# Altium schematic sheet LED.SchDoc: Giant 7 Digit I2C Display
size A4; Revision: 1.0; SheetNumber: 1; SheetTotal: 1
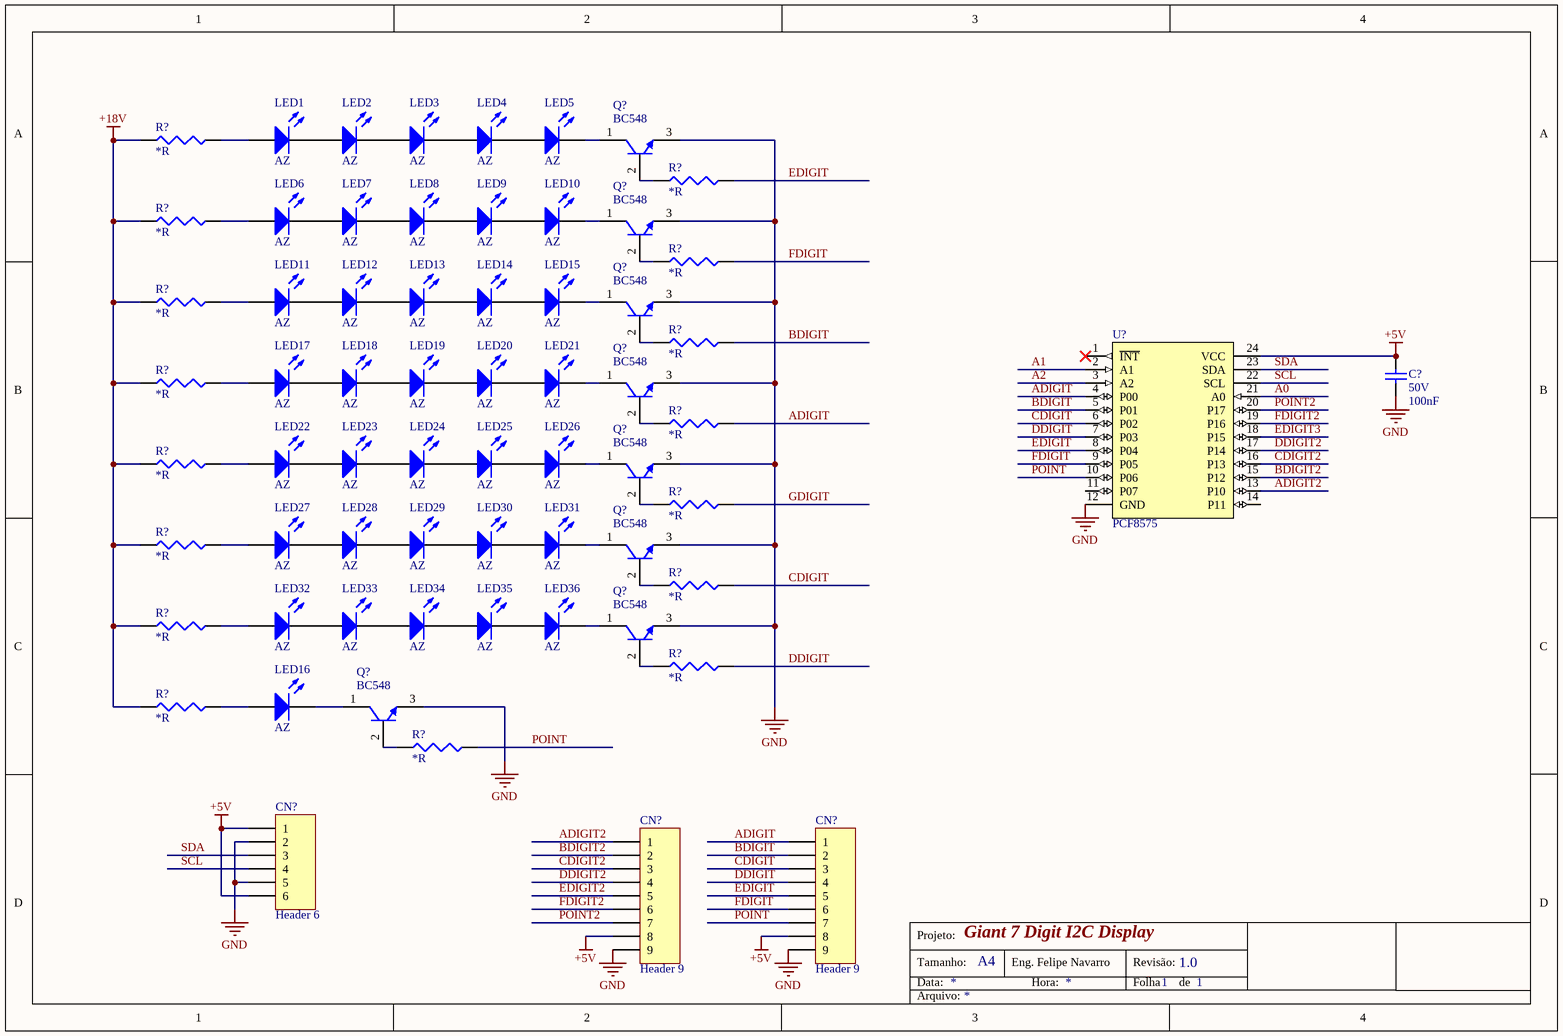
[diagram p0: LED.SchDoc]

## Parts
(Parts that share a designator on the sheet are numbered #1, #2 ... from top to bottom, then left to right.)
C?  value 100nF  Tensão: 50V  [CC0603]  (hidden comment: Capacitor Cerâmico)
CN?#1  Header 6  [CONN HDR1X6]
CN?#2  Header 9  [CONN HDR1X9]
CN?#3  Header 9  [CONN HDR1X9]
LED1  value AZ  [LED 5MM]  (hidden comment: LED TH 5MM AZ)
LED2  value AZ  [LED 5MM]  (hidden comment: LED TH 5MM AZ)
LED3  value AZ  [LED 5MM]  (hidden comment: LED TH 5MM AZ)
LED4  value AZ  [LED 5MM]  (hidden comment: LED TH 5MM AZ)
LED5  value AZ  [LED 5MM]  (hidden comment: LED TH 5MM AZ)
LED6  value AZ  [LED 5MM]  (hidden comment: LED TH 5MM AZ)
LED7  value AZ  [LED 5MM]  (hidden comment: LED TH 5MM AZ)
LED8  value AZ  [LED 5MM]  (hidden comment: LED TH 5MM AZ)
LED9  value AZ  [LED 5MM]  (hidden comment: LED TH 5MM AZ)
LED10  value AZ  [LED 5MM]  (hidden comment: LED TH 5MM AZ)
LED11  value AZ  [LED 5MM]  (hidden comment: LED TH 5MM AZ)
LED12  value AZ  [LED 5MM]  (hidden comment: LED TH 5MM AZ)
LED13  value AZ  [LED 5MM]  (hidden comment: LED TH 5MM AZ)
LED14  value AZ  [LED 5MM]  (hidden comment: LED TH 5MM AZ)
LED15  value AZ  [LED 5MM]  (hidden comment: LED TH 5MM AZ)
LED16  value AZ  [LED 5MM]  (hidden comment: LED TH 5MM AZ)
LED17  value AZ  [LED 5MM]  (hidden comment: LED TH 5MM AZ)
LED18  value AZ  [LED 5MM]  (hidden comment: LED TH 5MM AZ)
LED19  value AZ  [LED 5MM]  (hidden comment: LED TH 5MM AZ)
LED20  value AZ  [LED 5MM]  (hidden comment: LED TH 5MM AZ)
LED21  value AZ  [LED 5MM]  (hidden comment: LED TH 5MM AZ)
LED22  value AZ  [LED 5MM]  (hidden comment: LED TH 5MM AZ)
LED23  value AZ  [LED 5MM]  (hidden comment: LED TH 5MM AZ)
LED24  value AZ  [LED 5MM]  (hidden comment: LED TH 5MM AZ)
LED25  value AZ  [LED 5MM]  (hidden comment: LED TH 5MM AZ)
LED26  value AZ  [LED 5MM]  (hidden comment: LED TH 5MM AZ)
LED27  value AZ  [LED 5MM]  (hidden comment: LED TH 5MM AZ)
LED28  value AZ  [LED 5MM]  (hidden comment: LED TH 5MM AZ)
LED29  value AZ  [LED 5MM]  (hidden comment: LED TH 5MM AZ)
LED30  value AZ  [LED 5MM]  (hidden comment: LED TH 5MM AZ)
LED31  value AZ  [LED 5MM]  (hidden comment: LED TH 5MM AZ)
LED32  value AZ  [LED 5MM]  (hidden comment: LED TH 5MM AZ)
LED33  value AZ  [LED 5MM]  (hidden comment: LED TH 5MM AZ)
LED34  value AZ  [LED 5MM]  (hidden comment: LED TH 5MM AZ)
LED35  value AZ  [LED 5MM]  (hidden comment: LED TH 5MM AZ)
LED36  value AZ  [LED 5MM]  (hidden comment: LED TH 5MM AZ)
Q?#1  BC548  [TO-92]
Q?#2  BC548  [TO-92]
Q?#3  BC548  [TO-92]
Q?#4  BC548  [TO-92]
Q?#5  BC548  [TO-92]
Q?#6  BC548  [TO-92]
Q?#7  BC548  [TO-92]
Q?#8  BC548  [TO-92]
R?#1  value *R  [Axial 0.125W/H]  (hidden comment: Resistor)
R?#2  value *R  [Axial 0.125W/H]  (hidden comment: Resistor)
R?#3  value *R  [Axial 0.125W/H]  (hidden comment: Resistor)
R?#4  value *R  [Axial 0.125W/H]  (hidden comment: Resistor)
R?#5  value *R  [Axial 0.125W/H]  (hidden comment: Resistor)
R?#6  value *R  [Axial 0.125W/H]  (hidden comment: Resistor)
R?#7  value *R  [Axial 0.125W/H]  (hidden comment: Resistor)
R?#8  value *R  [Axial 0.125W/H]  (hidden comment: Resistor)
R?#9  value *R  [Axial 0.125W/H]  (hidden comment: Resistor)
R?#10  value *R  [Axial 0.125W/H]  (hidden comment: Resistor)
R?#11  value *R  [Axial 0.125W/H]  (hidden comment: Resistor)
R?#12  value *R  [Axial 0.125W/H]  (hidden comment: Resistor)
R?#13  value *R  [Axial 0.125W/H]  (hidden comment: Resistor)
R?#14  value *R  [Axial 0.125W/H]  (hidden comment: Resistor)
R?#15  value *R  [Axial 0.125W/H]  (hidden comment: Resistor)
R?#16  value *R  [Axial 0.125W/H]  (hidden comment: Resistor)
U?  PCF8575  [TSSOP-24N]

## Nets
+5V: C?.2 CN?#1.1 CN?#1.6 CN?#2.8 CN?#3.8 U?.24(VCC)
+18V: R?#1.1 R?#3.1 R?#5.1 R?#7.1 R?#9.1 R?#11.1 R?#13.1 R?#15.1
GND: C?.1 CN?#1.2 CN?#1.5 CN?#2.9 CN?#3.9 Q?#1.3(E) Q?#2.3(E) Q?#3.3(E) Q?#4.3(E) Q?#5.3(E) Q?#6.3(E) Q?#7.3(E) Q?#8.3(E) U?.12(GND)
A0: U?.21(A0)
A1: U?.2(A1)
A2: U?.3(A2)
ADIGIT: CN?#3.1 R?#8.2 U?.4(P00)
ADIGIT2: CN?#2.1 U?.13(P10)
BDIGIT: CN?#3.2 R?#6.2 U?.5(P01)
BDIGIT2: CN?#2.2 U?.15(P12)
CDIGIT: CN?#3.3 R?#12.2 U?.6(P02)
CDIGIT2: CN?#2.3 U?.16(P13)
DDIGIT: CN?#3.4 R?#14.2 U?.7(P03)
DDIGIT2: CN?#2.4 U?.17(P14)
EDIGIT: CN?#3.5 R?#2.2 U?.8(P04)
EDIGIT2: CN?#2.5
EDIGIT3: U?.18(P15)
FDIGIT: CN?#3.6 R?#4.2 U?.9(P05)
FDIGIT2: CN?#2.6 U?.19(P16)
GDIGIT: R?#10.2
POINT: CN?#3.7 R?#16.2 U?.10(P06)
POINT2: CN?#2.7 U?.20(P17)
SCL: CN?#1.4 U?.22(SCL)
SDA: CN?#1.3 U?.23(SDA)
NetLED1_1: LED1.1(A) R?#1.2
NetLED1_2: LED1.2(K) LED2.1(A)
NetLED2_2: LED2.2(K) LED3.1(A)
NetLED3_2: LED3.2(K) LED4.1(A)
NetLED4_2: LED4.2(K) LED5.1(A)
NetLED5_2: LED5.2(K) Q?#1.1(C)
NetLED6_1: LED6.1(A) R?#3.2
NetLED6_2: LED6.2(K) LED7.1(A)
NetLED7_2: LED7.2(K) LED8.1(A)
NetLED8_2: LED8.2(K) LED9.1(A)
NetLED9_2: LED9.2(K) LED10.1(A)
NetLED10_2: LED10.2(K) Q?#2.1(C)
NetLED11_1: LED11.1(A) R?#5.2
NetLED11_2: LED11.2(K) LED12.1(A)
NetLED12_2: LED12.2(K) LED13.1(A)
NetLED13_2: LED13.2(K) LED14.1(A)
NetLED14_2: LED14.2(K) LED15.1(A)
NetLED15_2: LED15.2(K) Q?#3.1(C)
NetLED16_1: LED16.1(A) R?#15.2
NetLED16_2: LED16.2(K) Q?#8.1(C)
NetLED17_1: LED17.1(A) R?#7.2
NetLED17_2: LED17.2(K) LED18.1(A)
NetLED18_2: LED18.2(K) LED19.1(A)
NetLED19_2: LED19.2(K) LED20.1(A)
NetLED20_2: LED20.2(K) LED21.1(A)
NetLED21_2: LED21.2(K) Q?#4.1(C)
NetLED22_1: LED22.1(A) R?#9.2
NetLED22_2: LED22.2(K) LED23.1(A)
NetLED23_2: LED23.2(K) LED24.1(A)
NetLED24_2: LED24.2(K) LED25.1(A)
NetLED25_2: LED25.2(K) LED26.1(A)
NetLED26_2: LED26.2(K) Q?#5.1(C)
NetLED27_1: LED27.1(A) R?#11.2
NetLED27_2: LED27.2(K) LED28.1(A)
NetLED28_2: LED28.2(K) LED29.1(A)
NetLED29_2: LED29.2(K) LED30.1(A)
NetLED30_2: LED30.2(K) LED31.1(A)
NetLED31_2: LED31.2(K) Q?#6.1(C)
NetLED32_1: LED32.1(A) R?#13.2
NetLED32_2: LED32.2(K) LED33.1(A)
NetLED33_2: LED33.2(K) LED34.1(A)
NetLED34_2: LED34.2(K) LED35.1(A)
NetLED35_2: LED35.2(K) LED36.1(A)
NetLED36_2: LED36.2(K) Q?#7.1(C)
NetQ?#1_2: Q?#1.2(B) R?#2.1
NetQ?#2_2: Q?#2.2(B) R?#4.1
NetQ?#3_2: Q?#3.2(B) R?#6.1
NetQ?#4_2: Q?#4.2(B) R?#8.1
NetQ?#5_2: Q?#5.2(B) R?#10.1
NetQ?#6_2: Q?#6.2(B) R?#12.1
NetQ?#7_2: Q?#7.2(B) R?#14.1
NetQ?#8_2: Q?#8.2(B) R?#16.1

Not connected (* = marked no-connect by the designer): U? 1(~{INT})* 11(P07) 14(P11)

## Notes on the sheet
- Projeto:
- Tamanho:
- Data:
- A4
- Eng. Felipe Navarro
- Hora:
- Revisão:
- Folha
- de
- Arquivo:

## Library data of the parts
C? = Cap 100nF 50V 0603 X7R: Capacitor (Semiconductor SIM Model); Chinês: Local; ChinesePrice: 0,00250; Corrente: *A; Potência: *W; Obs:: X7R; Tolerância: ±10%; Supplier 1: Digi-Key; Supplier Part Number 1: 1276-1000-1-ND; ComponentLink1Description: Datasheet; ComponentLink1URL: D:\Tecnoclade\Datasheet\!DataMissing.pdf
CN?#1 = Header 6: Header, 6-Pin; ChinesePrice: 0,10000; Chinês: Proved - Local; Value: Barra de 40 pinos - ATENÇÃO; Corrente: *; Potência: *; Supplier 1: Digi-Key; Supplier Part Number 1: A26509-40-ND; Tensão: *; Obs:: *; Tolerância: *; ComponentLink1Description: Datasheet; ComponentLink1URL: D:\Tecnoclade\Datasheet\!DataMissing.pdf
CN?#2 CN?#3 = Header 9: Header, 9-Pin; ChinesePrice: 0,10000; Chinês: Proved - Local; Value: Barra de 40 pinos - ATENÇÃO; Corrente: *; Potência: *; Supplier 1: Digi-Key; Supplier Part Number 1: A26509-40-ND; Tensão: *; Obs:: *; Tolerância: *; ComponentLink1Description: Datasheet; ComponentLink1URL: D:\Tecnoclade\Datasheet\!DataMissing.pdf
LED1-LED36 = LED TH 5MM AZ: LED; ChinesePrice: 0,00000; Chinês: ----; Tolerância: 2V7; Corrente: *; Potência: *; Supplier 1: Digi-Key; Supplier Part Number 1: 732-5019-ND; Tensão: *; Obs:: *; ComponentLink1Description: Datasheet; ComponentLink1URL: D:\Tecnoclade\Datasheet\!DataMissing.pdf
Q?#1-Q?#8 = TRS BC548 30V 100mA TO-92: NPN General Purpose Amplifier; Tensão: 30V; Corrente: 100mA; Chinês: ----; ChinesePrice: 0,00000; Value: 300MHz; Potência: *; Supplier 1: Digi-Key; Supplier Part Number 1: BC548CTAFSCT-ND; Obs:: *; Tolerância: *; ComponentLink1URL: D:\Tecnoclade\DatasheetBC548x.pdf; ComponentLink1Description: Datasheet
R?#1-R?#16 = Res - $Val $% $Footprint $Pot: ChinesePrice: 0,00000; Chinês: ----; Corrente: *A; Potência: 1/10W; Tensão: *V; Tolerância: ±*%; Supplier 1: Digi-Key; Supplier Part Number 1: --Del; Obs:: *; ComponentLink1Description: Datasheet; ComponentLink1URL: D:\Tecnoclade\Datasheet\!DataMissing.pdf
U? = PCF8575: I2C I/O Expander; ChinesePrice: 0,00000; Chinês: ----; Tensão: 2V3 ~ 5V5; Corrente: *; Potência: *; Value: *; Supplier 1: Digi-Key; Supplier Part Number 1: 568-1079-1-ND; Obs:: *; Tolerância: *; ComponentLink1Description: Datasheet; ComponentLink1URL: D:\Tecnoclade\Datasheet\PIC18F25K50.pdf